# EAGLE schematic Datalore-IP-M4 (EAGLE 9.1.0)
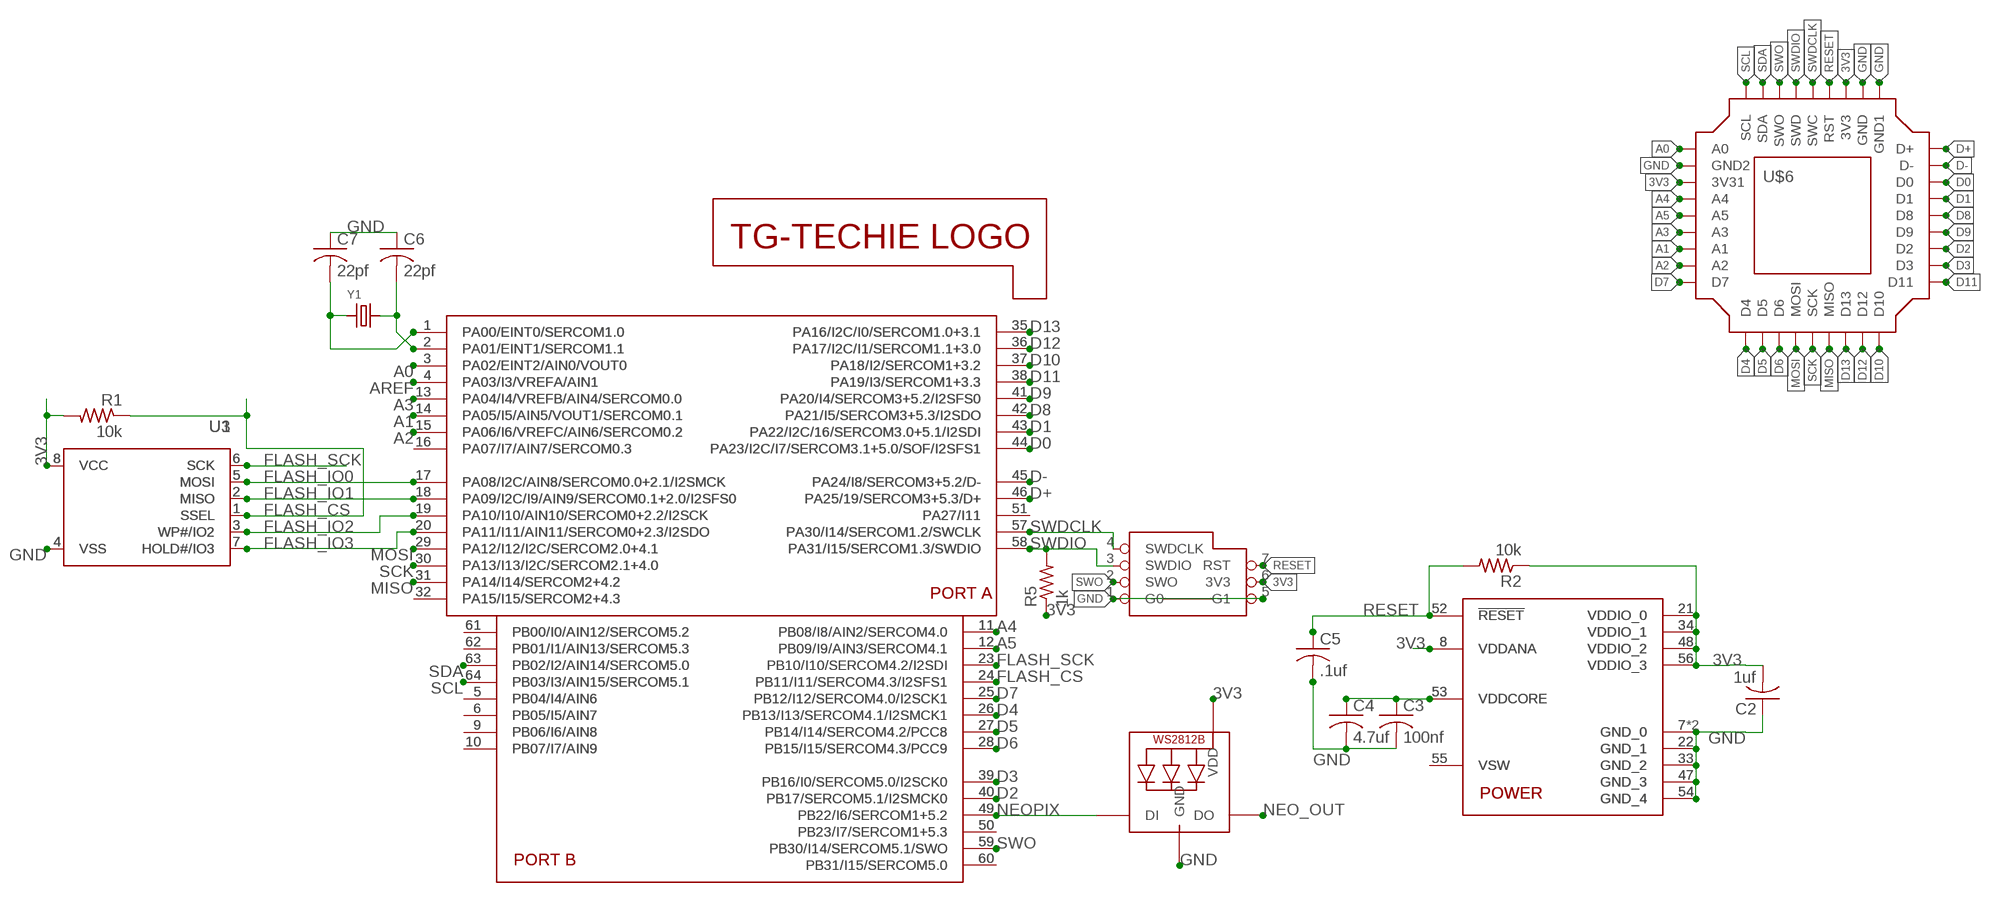
[diagram p0: schematic, sheet 1]

## Parts
C2  1uf  C-TG  [TG-C0805MP]
C3  100nf  C-TG  [TG-C0805MP]
C4  4.7uf  C-TG  [TG-C0805MP]
C5  .1uf  C-TG  [TG-C0805MP]
C6  22pf  C-TG  [TG-C0805MP]
C7  22pf  C-TG  [TG-C0805MP]
LED1  LED-NEO-WS2812B3535  [LED3535]
R1  10k  R_TG  [TG-R0805]
R2  10k  R_TG  [TG-R0805]
R5  1k  R_TG  [TG-R0805]
U1  FLASH-SPI-SOIC8  [SOIC8_150MIL]
U3  FLASH-SPI-SOIC8208MIL  [SOIC8_208MIL]
U$1  MCU-ATSAMD51J-ADATQFP  [QFP50P1200X1200X120-64N]
U$2  MCU-ATSAMD51J-ADAADA  [MICROBUILDER_PQFN64-1]
U$4  SWD_POGO  [SWD_POGO]
U$5  LOGO-TG_TECHIEBIG?  [LOGO_TG_TEST_LARGE]
U$6  DATALORE-IP-M4_PKG  [DL_IP_36-.1IN-PACKAGE]
Y1  XTAL_ADA4.9X1.8  [MICROBUILDER_CRYSTAL_4.9X1.8]

## Nets
3V3: C2.2 LED1.2(VDD) R1.2 R2.1 R5.1 U1.8(VCC) U3.8(VCC) U$1.8(VDDANA) U$1.21(VDDIO_0) U$1.34(VDDIO_1) U$1.48(VDDIO_2) U$1.56(VDDIO_3) U$2.8(VDDANA) U$2.21(VDDIO_0) U$2.34(VDDIO_1) U$2.48(VDDIO_2) U$2.56(VDDIO_3) U$4.6(3V3) U$6.7(3V3) U$6.34(3V31)
A0: U$1.3(PA02/EINT2/AIN0/VOUT0) U$2.3(PA02/EINT2/AIN0/VOUT0) U$6.36(A0)
A1: U$1.14(PA05/I5/AIN5/VOUT1/SERCOM0.1) U$2.14(PA05/I5/AIN5/VOUT1/SERCOM0.1) U$6.30(A1)
A2: U$1.15(PA06/I6/VREFC/AIN6/SERCOM0.2) U$2.15(PA06/I6/VREFC/AIN6/SERCOM0.2) U$6.29(A2)
A3: U$1.13(PA04/I4/VREFB/AIN4/SERCOM0.0) U$2.13(PA04/I4/VREFB/AIN4/SERCOM0.0) U$6.31(A3)
A4: U$1.11(PB08/I8/AIN2/SERCOM4.0) U$2.11(PB08/I8/AIN2/SERCOM4.0) U$6.33(A4)
A5: U$1.12(PB09/I9/AIN3/SERCOM4.1) U$2.12(PB09/I9/AIN3/SERCOM4.1) U$6.32(A5)
AREF: U$1.4(PA03/I3/VREFA/AIN1) U$2.4(PA03/I3/VREFA/AIN1)
D0: U$1.44(PA23/I2C/I7/SERCOM3.1+5.0/SOF/I2SFS1) U$2.44(PA23/I2C/I7/SERCOM3.1+5.0/SOF/I2SFS1) U$6.12(D0)
D1: U$1.43(PA22/I2C/16/SERCOM3.0+5.1/I2SDI) U$2.43(PA22/I2C/16/SERCOM3.0+5.1/I2SDI) U$6.13(D1)
D2: U$1.40(PB17/SERCOM5.1/I2SMCK0) U$2.40(PB17/SERCOM5.1/I2SMCK0) U$6.16(D2)
D3: U$1.39(PB16/I0/SERCOM5.0/I2SCK0) U$2.39(PB16/I0/SERCOM5.0/I2SCK0) U$6.17(D3)
D4: U$1.26(PB13/I13/SERCOM4.1/I2SMCK1) U$2.26(PB13/I13/SERCOM4.1/I2SMCK1) U$6.27(D4)
D5: U$1.27(PB14/I14/SERCOM4.2/PCC8) U$2.27(PB14/I14/SERCOM4.2/PCC8) U$6.26(D5)
D6: U$1.28(PB15/I15/SERCOM4.3/PCC9) U$2.28(PB15/I15/SERCOM4.3/PCC9) U$6.25(D6)
D7: U$1.25(PB12/I12/SERCOM4.0/I2SCK1) U$2.25(PB12/I12/SERCOM4.0/I2SCK1) U$6.28(D7)
D8: U$1.42(PA21/I5/SERCOM3+5.3/I2SDO) U$2.42(PA21/I5/SERCOM3+5.3/I2SDO) U$6.14(D8)
D9: U$1.41(PA20/I4/SERCOM3+5.2/I2SFS0) U$2.41(PA20/I4/SERCOM3+5.2/I2SFS0) U$6.15(D9)
D10: U$1.37(PA18/I2/SERCOM1+3.2) U$2.37(PA18/I2/SERCOM1+3.2) U$6.19(D10)
D11: U$1.38(PA19/I3/SERCOM1+3.3) U$2.38(PA19/I3/SERCOM1+3.3) U$6.18(D11)
D12: U$1.36(PA17/I2C/I1/SERCOM1.1+3.0) U$2.36(PA17/I2C/I1/SERCOM1.1+3.0) U$6.20(D12)
D13: U$1.35(PA16/I2C/I0/SERCOM1.0+3.1) U$2.35(PA16/I2C/I0/SERCOM1.0+3.1) U$6.21(D13)
D+: U$1.46(PA25/19/SERCOM3+5.3/D+) U$2.46(PA25/19/SERCOM3+5.3/D+) U$6.10(D+)
D-: U$1.45(PA24/I8/SERCOM3+5.2/D-) U$2.45(PA24/I8/SERCOM3+5.2/D-) U$6.11(D-)
FLASH_CS: R1.1 U1.1(SSEL) U3.1(SSEL) U$1.24(PB11/I11/SERCOM4.3/I2SFS1) U$2.24(PB11/I11/SERCOM4.3/I2SFS1)
FLASH_IO0: U1.5(MOSI) U3.5(MOSI) U$1.17(PA08/I2C/AIN8/SERCOM0.0+2.1/I2SMCK) U$2.17(PA08/I2C/AIN8/SERCOM0.0+2.1/I2SMCK)
FLASH_IO1: U1.2(MISO) U3.2(MISO) U$1.18(PA09/I2C/I9/AIN9/SERCOM0.1+2.0/I2SFS0) U$2.18(PA09/I2C/I9/AIN9/SERCOM0.1+2.0/I2SFS0)
FLASH_IO2: U1.3(WP#/IO2) U3.3(WP#/IO2) U$1.19(PA10/I10/AIN10/SERCOM0+2.2/I2SCK) U$2.19(PA10/I10/AIN10/SERCOM0+2.2/I2SCK)
FLASH_IO3: U1.7(HOLD#/IO3) U3.7(HOLD#/IO3) U$1.20(PA11/I11/AIN11/SERCOM0+2.3/I2SDO) U$2.20(PA11/I11/AIN11/SERCOM0+2.3/I2SDO)
FLASH_SCK: U1.6(SCK) U3.6(SCK) U$1.23(PB10/I10/SERCOM4.2/I2SDI) U$2.23(PB10/I10/SERCOM4.2/I2SDI)
GND: C2.1 C3.2 C4.2 C5.2 C6.1 C7.1 LED1.4(GND) U1.4(VSS) U3.4(VSS) U$1.7(GND_0) U$1.22(GND_1) U$1.33(GND_2) U$1.47(GND_3) U$1.54(GND_4) U$2.7(GND_0) U$2.22(GND_1) U$2.33(GND_2) U$2.47(GND_3) U$2.54(GND_4) U$2.EXP(GND_0) U$4.1(G0) U$4.5(G1) U$6.8(GND) U$6.9(GND1) U$6.35(GND2)
MISO: U$1.31(PA14/I14/SERCOM2+4.2) U$2.31(PA14/I14/SERCOM2+4.2) U$6.22(MISO)
MOSI: U$1.29(PA12/I12/I2C/SERCOM2.0+4.1) U$2.29(PA12/I12/I2C/SERCOM2.0+4.1) U$6.24(MOSI)
N$1: U$1.16(PA07/I7/AIN7/SERCOM0.3) U$2.16(PA07/I7/AIN7/SERCOM0.3)
N$2: U$1.32(PA15/I15/SERCOM2+4.3) U$2.32(PA15/I15/SERCOM2+4.3)
N$3: U$1.51(PA27/I11) U$2.51(PA27/I11)
N$4: U$1.61(PB00/I0/AIN12/SERCOM5.2) U$2.61(PB00/I0/AIN12/SERCOM5.2)
N$5: U$1.62(PB01/I1/AIN13/SERCOM5.3) U$2.62(PB01/I1/AIN13/SERCOM5.3)
N$6: U$1.5(PB04/I4/AIN6) U$2.5(PB04/I4/AIN6)
N$7: U$1.6(PB05/I5/AIN7) U$2.6(PB05/I5/AIN7)
N$8: U$1.9(PB06/I6/AIN8) U$2.9(PB06/I6/AIN8)
N$9: U$1.10(PB07/I7/AIN9) U$2.10(PB07/I7/AIN9)
N$10: U$1.50(PB23/I7/SERCOM1+5.3) U$2.50(PB23/I7/SERCOM1+5.3)
N$11: U$1.60(PB31/I15/SERCOM5.0) U$2.60(PB31/I15/SERCOM5.0)
N$12: U$1.55(VSW) U$2.55(VSW)
NEO_OUT: LED1.3(DO)
NEOPIX: LED1.1(DI) U$1.49(PB22/I6/SERCOM1+5.2) U$2.49(PB22/I6/SERCOM1+5.2)
RESET: C5.1 R2.2 U$1.52(!RESET) U$2.52(!RESET) U$4.7(RST) U$6.6(RST)
SCK: U$1.30(PA13/I13/I2C/SERCOM2.1+4.0) U$2.30(PA13/I13/I2C/SERCOM2.1+4.0) U$6.23(SCK)
SCL: U$1.64(PB03/I3/AIN15/SERCOM5.1) U$2.64(PB03/I3/AIN15/SERCOM5.1) U$6.1(SCL)
SDA: U$1.63(PB02/I2/AIN14/SERCOM5.0) U$2.63(PB02/I2/AIN14/SERCOM5.0) U$6.2(SDA)
SWDCLK: U$1.57(PA30/I14/SERCOM1.2/SWCLK) U$2.57(PA30/I14/SERCOM1.2/SWCLK) U$4.4(SWDCLK) U$6.5(SWC)
SWDIO: R5.2 U$1.58(PA31/I15/SERCOM1.3/SWDIO) U$2.58(PA31/I15/SERCOM1.3/SWDIO) U$4.3(SWDIO) U$6.4(SWD)
SWO: U$1.59(PB30/I14/SERCOM5.1/SWO) U$2.59(PB30/I14/SERCOM5.1/SWO) U$4.2(SWO) U$6.3(SWO)
VCORE: C3.1 C4.1 U$1.53(VDDCORE) U$2.53(VDDCORE)
XTAL0: C6.2 U$1.2(PA01/EINT1/SERCOM1.1) U$2.2(PA01/EINT1/SERCOM1.1) Y1.2
XTAL1: C7.2 U$1.1(PA00/EINT0/SERCOM1.0) U$2.1(PA00/EINT0/SERCOM1.0) Y1.1

## Library data of the parts
C2-C7 = 0TG-Lib v01.3:C-TG
LED1 = 0TG-Lib v01.3:LED-NEO-WS2812B: from: adafruit
R1 R2 R5 = 0TG-Lib v01.3:R_TG
U1 U3 = 0TG-Lib v01.3:FLASH-SPI-SOIC8: SOIC8 SPI Flash Be careful with the size since SOIC8 flash comes in several 'widths' SOIC8 150 mil M25P16 - 16Mbit (2Mbit x 8) Serial Flash (75MHz SPI Bus), Supply: 2.7-3.6V Digikey: SOIC8 - M25P16-VMN6P-ND SOIC8 208 mil W25Q16BVSSIG - 16Mbit (2Mbit x 8) Serial Flash (104MHz SPI Bus), Supply: 2.7-3.6V Digikey: SOIC8 - W25Q16BVSSIG-ND from: adafruit availability low
U$1 = 0TG-Lib v01.3:MCU-ATSAMD51J-ADA: ATSAMD51J cortex m4 microcontroller from: adafruit altered: TG-Techie
U$2 = 0TG-Lib v01.4:MCU-ATSAMD51J-ADA: ATSAMD51J cortex m4 microcontroller from: adafruit altered: TG-Techie
U$4 = board packages dev:SWD_POGO
U$5 = 0TG-Lib v01.4:LOGO-TG_TECHIE
U$6 = board packages dev:DATALORE-IP-M4
Y1 = 0TG-Lib v01.3:XTAL_ADA: Crystals HC49UP - Surface Mount Crystal 4.0MHz 18pF +/-30ppm Surface Mount Crystal [Digikey: 535-9857-1-ND] 12.0 MHz Surface Mount Crystal [Digikey: 535-9869-6-ND] 25.0 MHz Surface Mount Crystal [Digikey: 535-9078-1-ND] 2.5 x 2.0mm - MEMs SMT Crystal 16.0 MHz 10pF 20ppm 2.5 x 2.0mm Crystal [Digikey -40-85°C: 535-10923-1-ND] 3.2 x 2.5mm - MEMs SMT Crystal 12.0 MHz 8pF 15ppm 3.2 x 2.5mm Crystal [Digikey: -10-70°C: 644-1047-1-ND -40-125°C: 644-1128-1-ND] 16.0 MHz 8pF 15ppm 3.2 x 2.5mm Crystal [Digikey: -10-70°C: 644-1049-1-ND -40-125°C: 644-1129-2-ND] 16.0 MHz 10pF 10ppm 3.2 x 2.5mm Crystal [Digikey: 644-1100-1-ND] 27.12 MHz 18pF 30ppm 3.2 x 2.5mm Crystal [Digikey: 887-1424-1-ND] 27.12MHz 10pF 10ppm 3.2 x 2.5mm Crystal [Digikey: 887-1329-1-ND] 4.9 x 1.8mm - MEMs SMT Crystal 32.768 KHz 12.5pF 20ppm 4.9 x 1.8mm Crystal [Digikey: SE2415CT-ND] 8.0 x 3.8mm - Surface Mount Crystal 32.768kHz 12.5pF 20ppm -40°C-85°C [Digikey: 535-9166-2-ND] Cylinder 32.768KHz Cylinder Crystal (2x6mm body) [Ex. Digikey: 300-8341-2-ND]